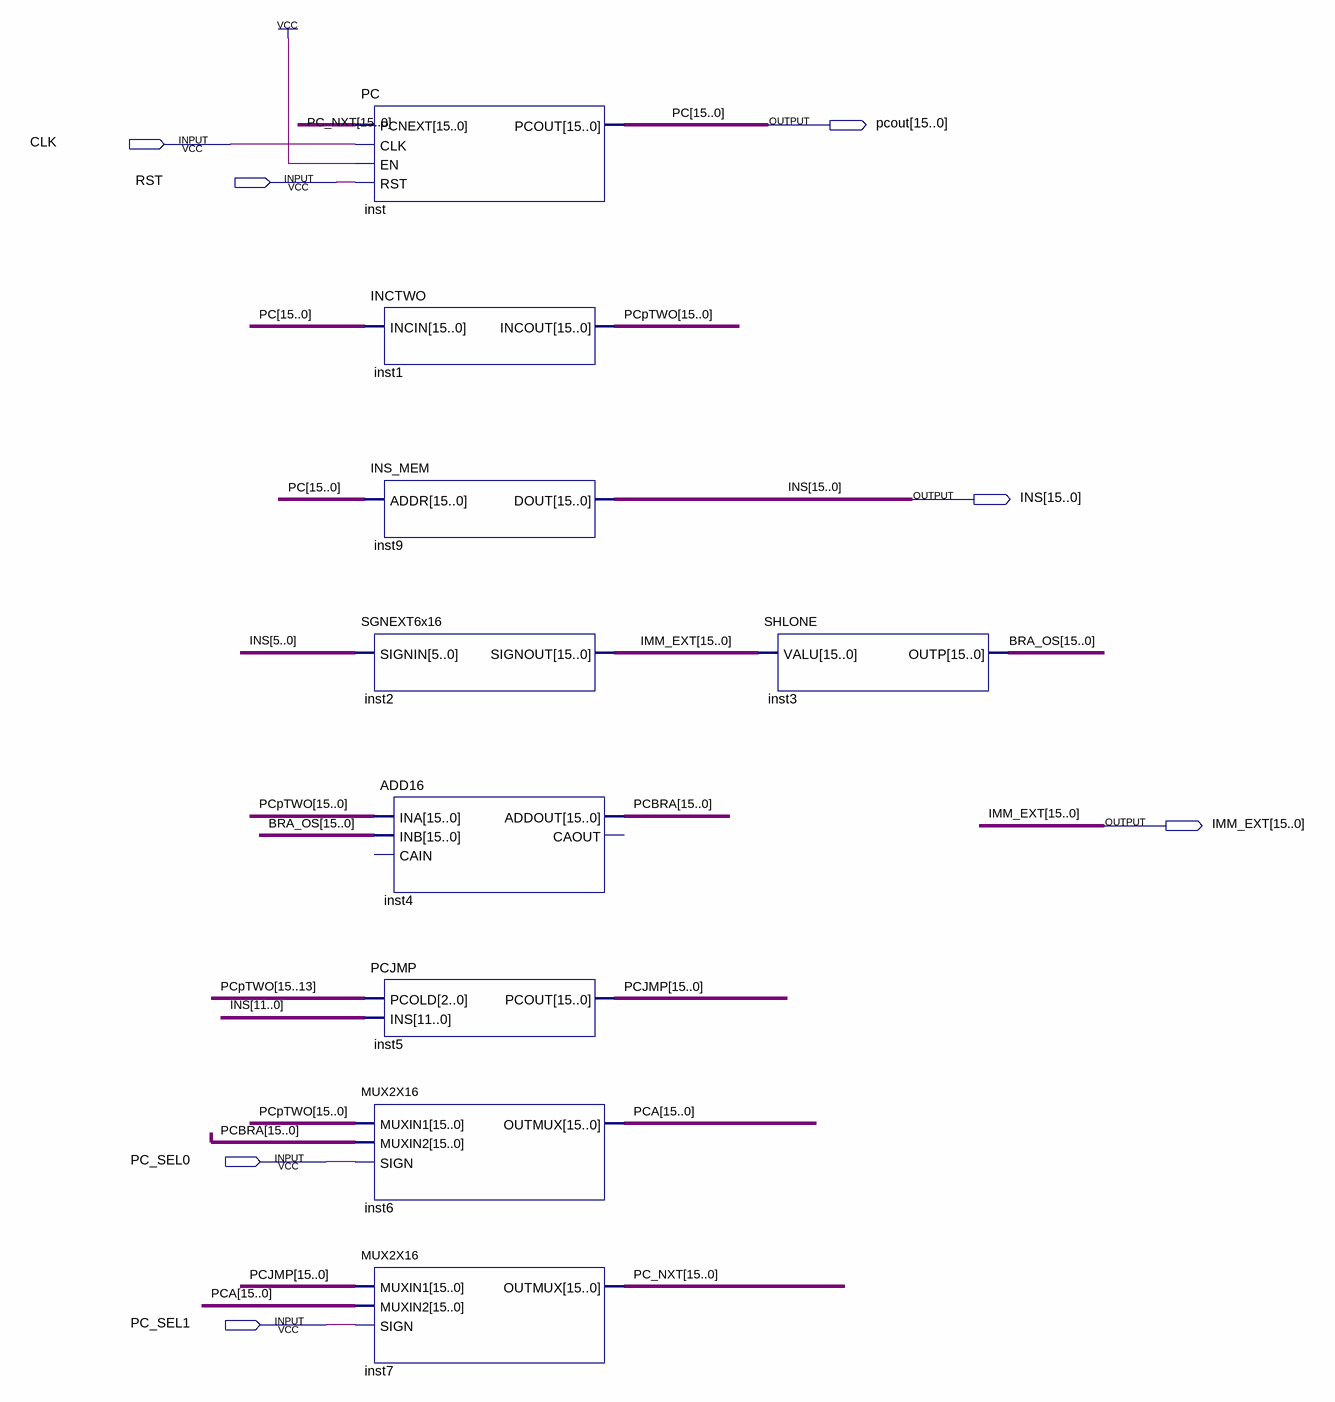
[diagram p0: schematic sheet]
// Quartus schematic Level2.bdf as structural Verilog: 9 symbols, 7 pins
module Level2 (
  input  CLK,
  input  RST,
  input  PC_SEL0,
  input  PC_SEL1,
  output [15:0] pcout,
  output [15:0] INS,
  output [15:0] IMM_EXT
);

  wire [15:0] BRA_OS, PC_NXT, PCA, PCBRA, PCJMP, PCpTWO;

  PC inst (.PCNEXT(PC_NXT), .CLK(CLK), .EN(1'b1), .RST(RST), .PCOUT(pcout));
  INCTWO inst1 (.INCIN(pcout), .INCOUT(PCpTWO));
  INS_MEM inst9 (.ADDR(pcout), .DOUT(INS));
  SGNEXT6x16 inst2 (.SIGNIN(INS[5:0]), .SIGNOUT(IMM_EXT));
  ADD16 inst4 (.INA(PCpTWO), .INB(BRA_OS), .ADDOUT(PCBRA));  // open: CAIN, CAOUT
  PCJMP inst5 (.PCOLD(PCpTWO[15:13]), .INS(INS[11:0]), .PCOUT(PCJMP));
  MUX2X16 inst6 (.MUXIN1(PCpTWO), .MUXIN2(PCBRA), .SIGN(PC_SEL0), .OUTMUX(PCA));
  MUX2X16 inst7 (.MUXIN1(PCJMP), .MUXIN2(PCA), .SIGN(PC_SEL1), .OUTMUX(PC_NXT));
  SHLONE inst3 (.VALU(IMM_EXT), .OUTP(BRA_OS));

  // Other names for the same wires on the sheet: PC[15:0] = pcout
endmodule
